# Altium schematic sheet Sheet2.SchDoc
size A; SheetNumber: 2; SheetTotal: 2
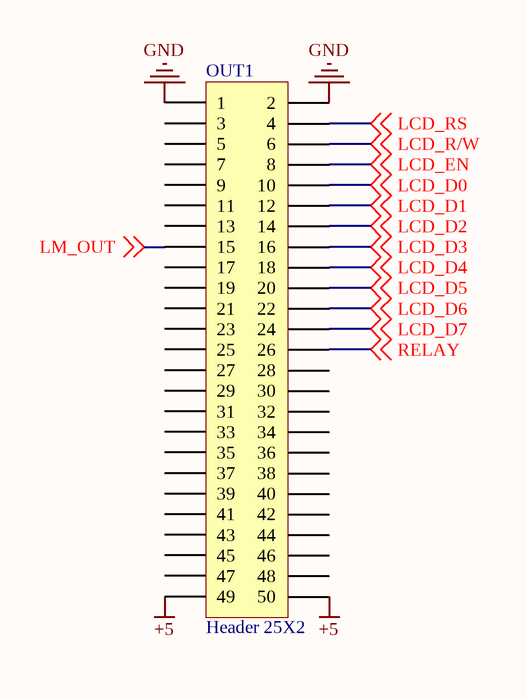
[diagram p0: Sheet2.SchDoc]

## Parts
OUT1  Header 25X2  [HDR2X25]

## Nets
+5: OUT1.49 OUT1.50
GND: OUT1.1 OUT1.2
LCD_D0: OUT1.10 ; off-sheet LCD_D0
LCD_D1: OUT1.12 ; off-sheet LCD_D1
LCD_D2: OUT1.14 ; off-sheet LCD_D2
LCD_D3: OUT1.16 ; off-sheet LCD_D3
LCD_D4: OUT1.18 ; off-sheet LCD_D4
LCD_D5: OUT1.20 ; off-sheet LCD_D5
LCD_D6: OUT1.22 ; off-sheet LCD_D6
LCD_D7: OUT1.24 ; off-sheet LCD_D7
LCD_EN: OUT1.8 ; off-sheet LCD_EN
LCD_R/W: OUT1.6 ; off-sheet LCD_R/W
LCD_RS: OUT1.4 ; off-sheet LCD_RS
LM_OUT: OUT1.15 ; off-sheet LM_OUT
RELAY: OUT1.26 ; off-sheet RELAY

Not connected (* = marked no-connect by the designer): OUT1 3 5 7 9 11 13 17 19 21 23 25 27 28 29 30 31 32 33 34 35 36 37 38 39 40 41 42 43 44 45 46 47 48

## Library data of the parts
OUT1 = Header 25X2: Header, 25-Pin, Dual row; LatestRevisionDate: 17-Jul-2002; LatestRevisionNote: Re-released for DXP Platform.; Publisher: Altium Limited